# EAGLE schematic Laser Monitor (EAGLE 7.6.0)
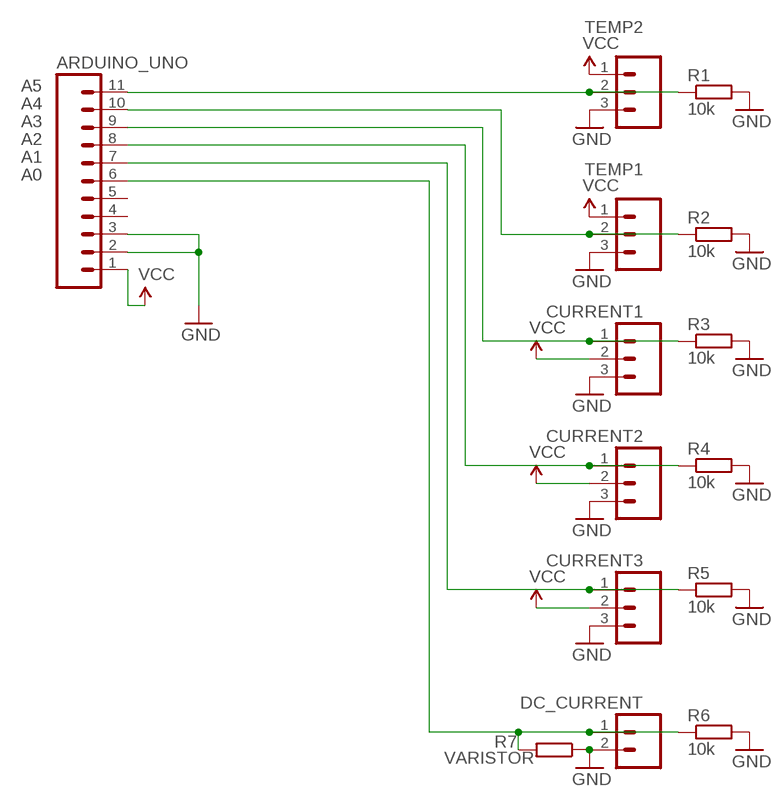
[diagram p0: schematic, sheet 1]

## Parts
ARDUINO_UNO  M11PTH  [1X11]
CURRENT1  M03PTH  [1X03]
CURRENT2  M03PTH  [1X03]
CURRENT3  M03PTH  [1X03]
DC_CURRENT  M02PTH  [1X02]
R1  10k  R-EU_0204/2V  [0204V]
R2  10k  R-EU_0204/2V  [0204V]
R3  10k  R-EU_0204/2V  [0204V]
R4  10k  R-EU_0204/2V  [0204V]
R5  10k  R-EU_0204/2V  [0204V]
R6  10k  R-EU_0204/2V  [0204V]
R7  VARISTOR  R-EU_0817/7V  [P0817V]
TEMP1  M03PTH  [1X03]
TEMP2  M03PTH  [1X03]

## Nets
A0: ARDUINO_UNO.6 DC_CURRENT.1 R6.1 R7.2
A1: ARDUINO_UNO.7 CURRENT3.1 R5.1
A2: ARDUINO_UNO.8 CURRENT2.1 R4.1
A3: ARDUINO_UNO.9 CURRENT1.1 R3.1
A4: ARDUINO_UNO.10 R2.1 TEMP1.2
A5: ARDUINO_UNO.11 R1.1 TEMP2.2
GND: ARDUINO_UNO.2 ARDUINO_UNO.3 CURRENT1.3 CURRENT2.3 CURRENT3.3 DC_CURRENT.2 R1.2 R2.2 R3.2 R4.2 R5.2 R6.2 R7.1 TEMP1.3 TEMP2.3
VCC: ARDUINO_UNO.1 CURRENT1.2 CURRENT2.2 CURRENT3.2 TEMP1.1 TEMP2.1
Unconnected: ARDUINO_UNO.4 ARDUINO_UNO.5

## Library data of the parts
ARDUINO_UNO = SparkFun-Connectors:M11: Header 11 Standard 11-pin 0.1" header. Use with straight break away headers (SKU : PRT-00116), right angle break away headers (PRT-00553), swiss pins (PRT-00743), machine pins (PRT-00117), and female headers (PRT-00115).
CURRENT1-CURRENT3 TEMP1 TEMP2 = SparkFun-Connectors:M03: Header 3 Standard 3-pin 0.1" header. Use with straight break away headers (SKU : PRT-00116), right angle break away headers (PRT-00553), swiss pins (PRT-00743), machine pins (PRT-00117), and female headers (PRT-00115). Molex polarized connector foot print use with SKU : PRT-08232 with associated crimp pins and housings.
DC_CURRENT = SparkFun-Connectors:M02: Standard 2-pin 0.1" header. Use with - straight break away headers ( PRT-00116) - right angle break away headers (PRT-00553) - swiss pins (PRT-00743) - machine pins (PRT-00117) - female headers (PRT-00115) Molex polarized connector foot print use with: PRT-08233 with associated crimp pins and housings. 2.54_SCREWTERM for use with PRT-10571. 3.5mm Screw Terminal footprints for PRT-08084 5mm Screw Terminal footprints for use with PRT-08432
R1-R7 = resistor:R-EU_: RESISTOR, European symbol